# EAGLE schematic untitled (EAGLE 9.2.2)
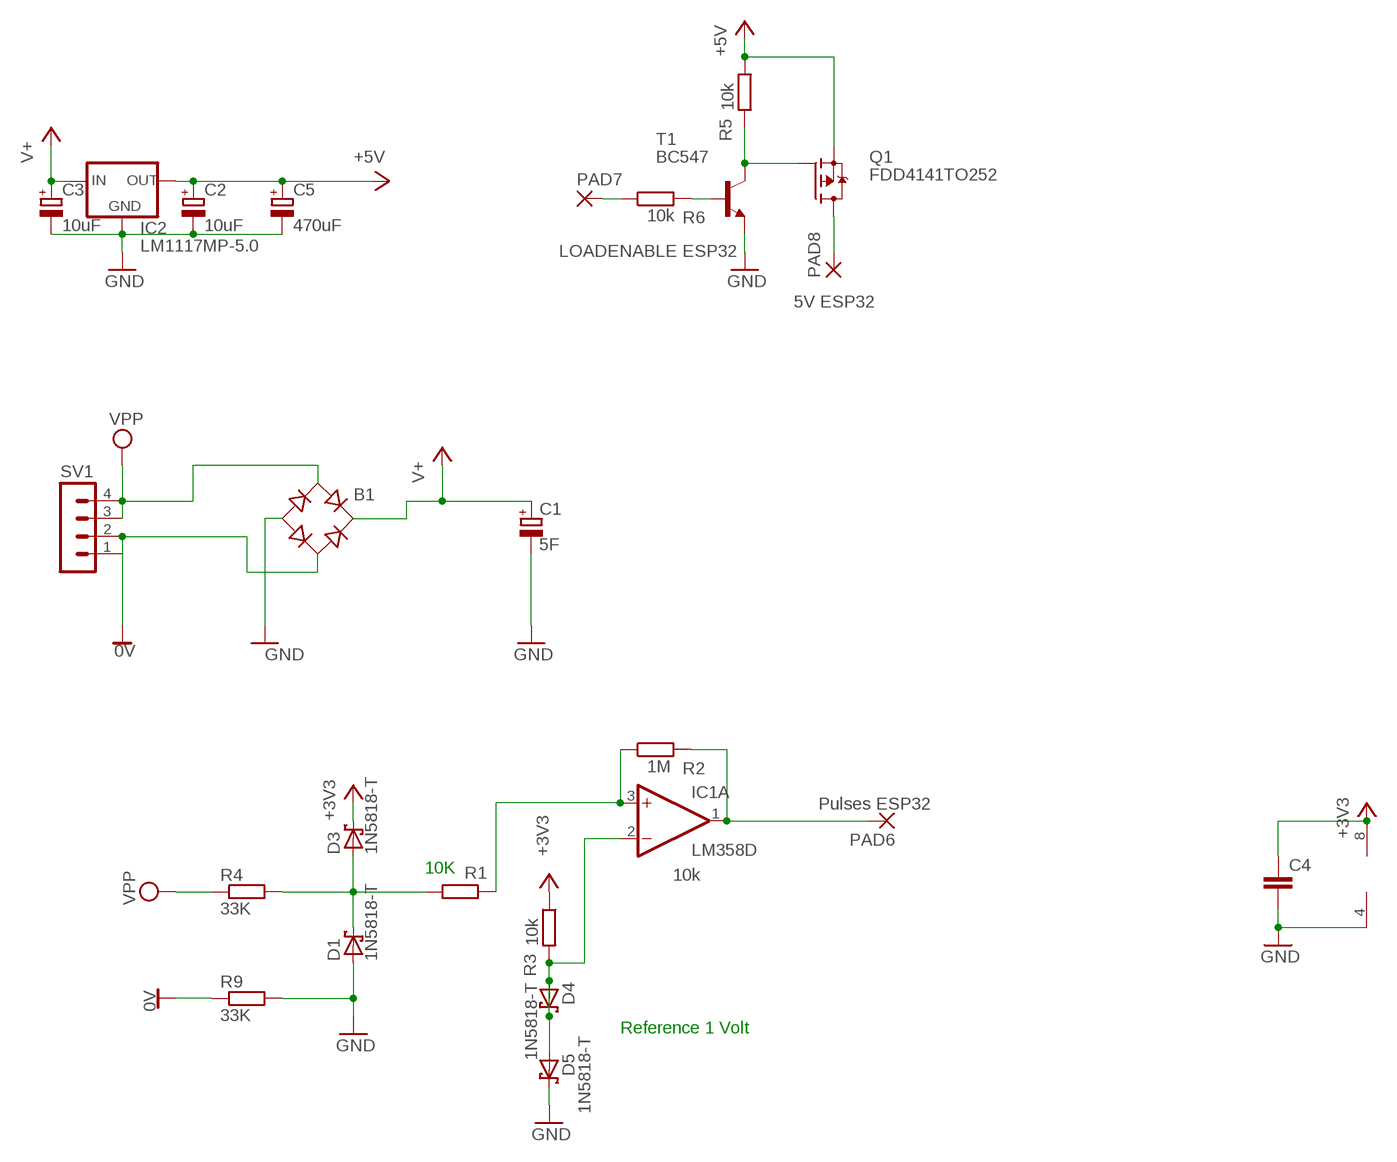
[diagram p0: schematic, sheet 1]

## Parts
B1  B-DIL  [B-DIL]
C1  5F  CPOL-EUE2,5-6E  [E2,5-6E]
C2  10uF  CPOL-EUE2,5-6E  [E2,5-6E]
C3  10uF  CPOL-EUE2,5-6E  [E2,5-6E]
C4  C-EU050-024X044  [C050-024X044]
C5  470uF  CPOL-EUE2,5-6E  [E2,5-6E]
D1  1N5818-T  [DO41-7.6]
D3  1N5818-T  [DO41-7.6]
D4  1N5818-T  [DO41-7.6]
D5  1N5818-T  [DO41-7.6]
IC1  LM358D  [SO08]
IC2  LM1117MP-5.0  [SOT223]
PAD6  Pulses ESP32  2,15/1,0  [2,15/1,0]
PAD7  LOADENABLE ESP32  2,15/1,0  [2,15/1,0]
PAD8  5V ESP32  2,15/1,0  [2,15/1,0]
Q1  FDD4141TO252  [TO252]
R1  10k  R-EU_0204/2V  [0204V]
R2  1M  R-EU_0204/2V  [0204V]
R3  10k  R-EU_0204/2V  [0204V]
R4  33K  R-EU_0204/2V  [0204V]
R5  10k  R-EU_0204/2V  [0204V]
R6  10k  R-EU_0204/2V  [0204V]
R9  33K  R-EU_0204/2V  [0204V]
SV1  MA04-1  [MA04-1]
T1  BC547  [TO92]

## Nets
0V: B1.AC2 R9.1 SV1.1 SV1.2
+3V3: B1.+ C1.+ C4.1 D3.C IC1.8(P:V+) R3.1 ; supply symbol labelled V+
+5V: C2.+ C5.+ IC2.2(OUT) IC2.4(OUT) Q1.2(S) R5.1
GND: B1.- C1.- C2.- C3.- C4.2 C5.- D1.A D5.C IC1.4(P:V-) IC2.1(GND) R9.2 T1.1(E)
N$3: IC1.1(A:OUT) PAD6.1(P) R2.2
N$4: PAD7.1(P) R6.1
N$5: R6.2 T1.2(B)
N$6: IC1.3(A:+IN) R1.1 R2.1
N$7: D4.A D4.C D5.A IC1.2(A:-IN) R3.2
N$9: Q1.1(G) R5.2 T1.3(C)
N$10: PAD8.1(P) Q1.3(D)
N$11: D1.C D3.A R1.2 R4.2
V+: C3.+ IC2.3(IN)
VPP: B1.AC1 R4.1 SV1.3 SV1.4
Unconnected: IC1.5(B:+IN) IC1.6(B:-IN) IC1.7(B:OUT)

## Notes on the sheet
- 10K
- Reference 1 Volt

## Library data of the parts
B1 = rectifier:B-DIL: RECTIFIER
C1-C3 C5 = rcl:CPOL-EU: POLARIZED CAPACITOR, European symbol; SPICEPREFIX: C
C4 = rcl:C-EU: CAPACITOR, European symbol; SPICEPREFIX: C
D1 D3-D5 = diode:1N581*: 1.0A SCHOTTKY BARRIER RECTIFIER Source: http://www.diodes.com/datasheets/ds23001.pdf
IC1 = linear:LM358: OP AMP also LM158; LM258; LM2904 Source: http://cache.national.com/ds/LM/LM158.pdf
IC2 = lm1117_11:LM1117?-*: 800mA Low-Dropout Linear Regulator Source: http://www.ti.com/lit/ds/symlink/lm1117-n.pdf; MF: Texas Instruments; MPN: LM1117MP-5.0; OC_FARNELL: 9778209; OC_NEWARK: 28X3417
PAD6-PAD8 = wirepad:2,15/1,0: THROUGH-HOLE PAD
Q1 = transistor-fet:FDD4141: P-Channel PowerTrench® MOSFET Source: FDD4141.pdf
R1-R3 R5 R6 = rcl:R-EU_: RESISTOR, European symbol; SPICEPREFIX: R
R4 R9 = rcl:R-EU_: RESISTOR, European symbol; SPICEPREFIX: 4K7
SV1 = con-lstb:MA04-1: PIN HEADER; OC_FARNELL: unknown; OC_NEWARK: unknown
T1 = transistor:BC547: NPN TRANSISTOR